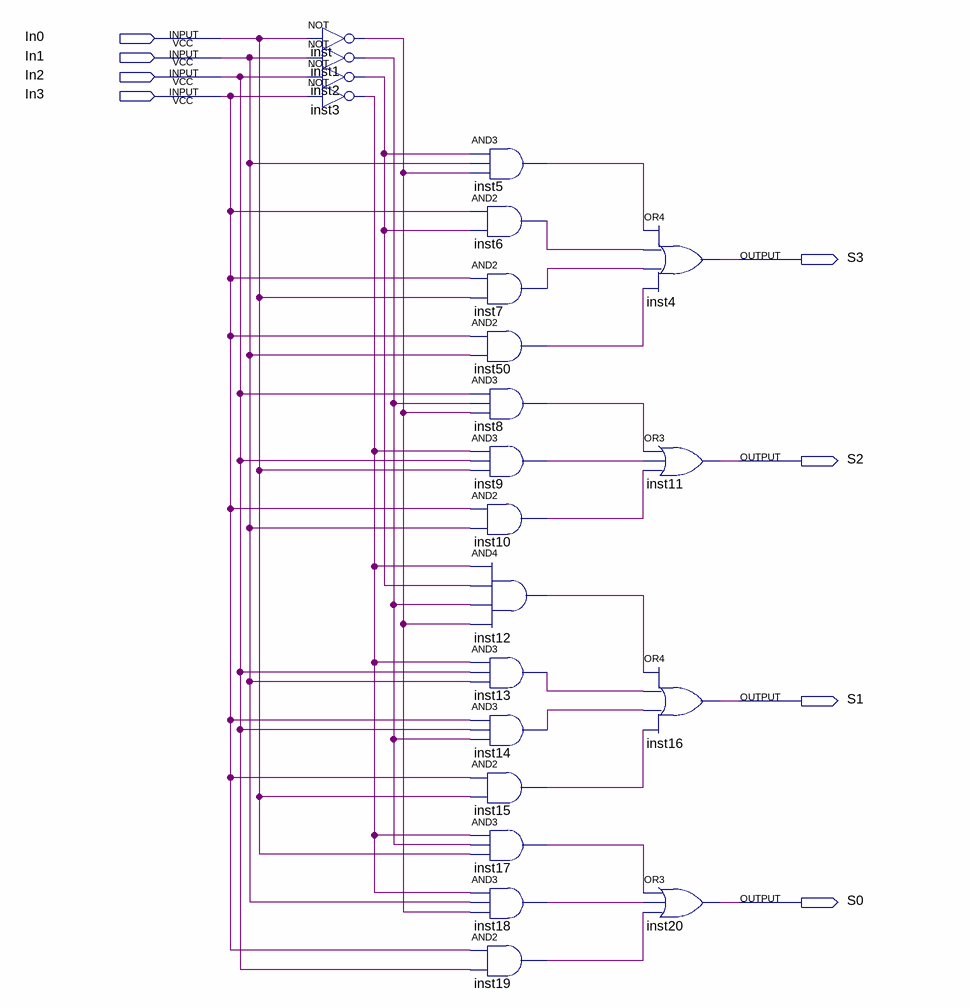
[diagram p0: schematic sheet]
// Quartus schematic RA_Dec.bdf as structural Verilog: 22 symbols, 8 pins
module RA_Dec (
  input  In0,
  input  In1,
  input  In2,
  input  In3,
  output S3,
  output S2,
  output S1,
  output S0
);

  wire inst1_out, inst2_out, inst3_out, inst5_out, inst6_out, inst7_out, inst8_out, inst9_out, inst10_out,
       inst12_out, inst13_out, inst14_out, inst15_out, inst17_out, inst18_out, inst19_out, inst50_out,
       inst_out;

  not inst (inst_out, In0);
  not inst1 (inst1_out, In1);
  not inst2 (inst2_out, In2);
  not inst3 (inst3_out, In3);
  and inst5 (inst5_out, inst2_out, In1, inst_out);
  and inst6 (inst6_out, In3, inst2_out);
  and inst7 (inst7_out, In3, In0);
  and inst50 (inst50_out, In3, In1);
  and inst8 (inst8_out, In2, inst1_out, inst_out);
  and inst9 (inst9_out, inst3_out, In2, In0);
  and inst10 (inst10_out, In3, In1);
  and inst12 (inst12_out, inst3_out, inst2_out, inst1_out, inst_out);
  and inst13 (inst13_out, inst3_out, In2, In1);
  and inst14 (inst14_out, In3, In2, inst1_out);
  and inst15 (inst15_out, In3, In0);
  and inst17 (inst17_out, inst3_out, inst1_out, In0);
  and inst18 (inst18_out, inst3_out, In1, inst_out);
  and inst19 (inst19_out, In3, In2);
  or inst4 (S3, inst5_out, inst6_out, inst7_out, inst50_out);
  or inst11 (S2, inst8_out, inst9_out, inst10_out);
  or inst16 (S1, inst12_out, inst13_out, inst14_out, inst15_out);
  or inst20 (S0, inst17_out, inst18_out, inst19_out);
endmodule
